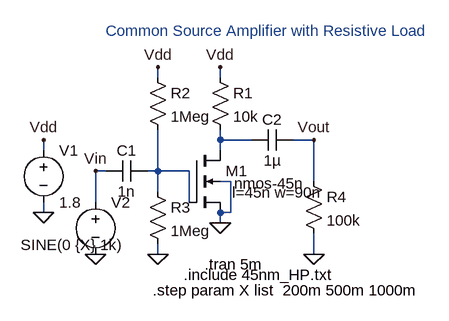
[diagram p0: schematic Common Source Amplifier.asc]
Common Source Amplifier.asc, the LTspice schematic file:
Version 4
SHEET 1 880 680
WIRE 80 -16 80 -32
WIRE 176 -16 176 -32
WIRE 176 80 176 64
WIRE 224 80 176 80
WIRE 320 80 288 80
WIRE -96 96 -96 80
WIRE 176 96 176 80
WIRE 0 128 -16 128
WIRE 80 128 80 64
WIRE 80 128 64 128
WIRE 128 128 80 128
WIRE 192 144 176 144
WIRE 320 144 320 80
WIRE 80 160 80 128
WIRE -16 176 -16 128
WIRE 128 176 128 128
WIRE -96 192 -96 176
WIRE 192 192 192 144
WIRE 192 192 176 192
WIRE 176 208 176 192
WIRE 80 256 80 240
WIRE 320 256 320 224
FLAG -16 256 0
FLAG 176 208 0
FLAG -96 192 0
FLAG 80 256 0
FLAG -96 80 Vdd
FLAG 80 -32 Vdd
FLAG 176 -32 Vdd
FLAG 320 256 0
FLAG -16 128 Vin
FLAG 320 80 Vout
SYMBOL nmos4 128 96 R0
WINDOW 3 69 51 Left 2
WINDOW 123 66 65 Left 2
SYMATTR Value nmos-45n
SYMATTR Value2 l=45n w=90n
SYMATTR InstName M1
SYMBOL voltage -96 80 R0
WINDOW 123 0 0 Left 2
WINDOW 39 0 0 Left 2
SYMATTR InstName V1
SYMATTR Value 1.8
SYMBOL voltage -16 160 R0
WINDOW 123 0 0 Left 2
WINDOW 39 0 0 Left 2
WINDOW 3 -115 82 Left 2
SYMATTR InstName V2
SYMATTR Value SINE(0 {X} 1k)
SYMBOL res 160 -32 R0
SYMATTR InstName R1
SYMATTR Value 10k
SYMBOL res 64 -32 R0
SYMATTR InstName R2
SYMATTR Value 1Meg
SYMBOL res 64 144 R0
SYMATTR InstName R3
SYMATTR Value 1Meg
SYMBOL cap 64 112 R90
WINDOW 0 0 32 VBottom 2
WINDOW 3 32 32 VTop 2
SYMATTR InstName C1
SYMATTR Value 1n
SYMBOL cap 288 64 R90
WINDOW 0 0 32 VBottom 2
WINDOW 3 32 32 VTop 2
SYMATTR InstName C2
SYMATTR Value 1µ
SYMBOL res 304 128 R0
SYMATTR InstName R4
SYMATTR Value 100k
TEXT 120 288 Left 2 !.include 45nm_HP.txt
TEXT 152 272 Left 2 !.tran 5m
TEXT 72 312 Left 2 !.step param X list  200m 500m 1000m
TEXT 0 -88 Left 2 ;Common Source Amplifier with Resistive Load

The netlist it stands for:
* Common Source Amplifier.asc
M1 N001 N002 0 0 nmos-45n l=45n w=90n
V1 Vdd 0 1.8
V2 Vin 0 SINE(0 {X} 1k)
R1 Vdd N001 10k
R2 Vdd N002 1Meg
R3 N002 0 1Meg
C1 N002 Vin 1n
C2 Vout N001 1µ
R4 Vout 0 100k
.model NMOS NMOS
.model PMOS PMOS
.lib standard.mos
.include 45nm_HP.txt
.tran 5m
.step param X list  200m 500m 1000m
* Common Source Amplifier with Resistive Load
.backanno
.end